# EAGLE design DAB+ FM Radio (EAGLE 9.0.0)
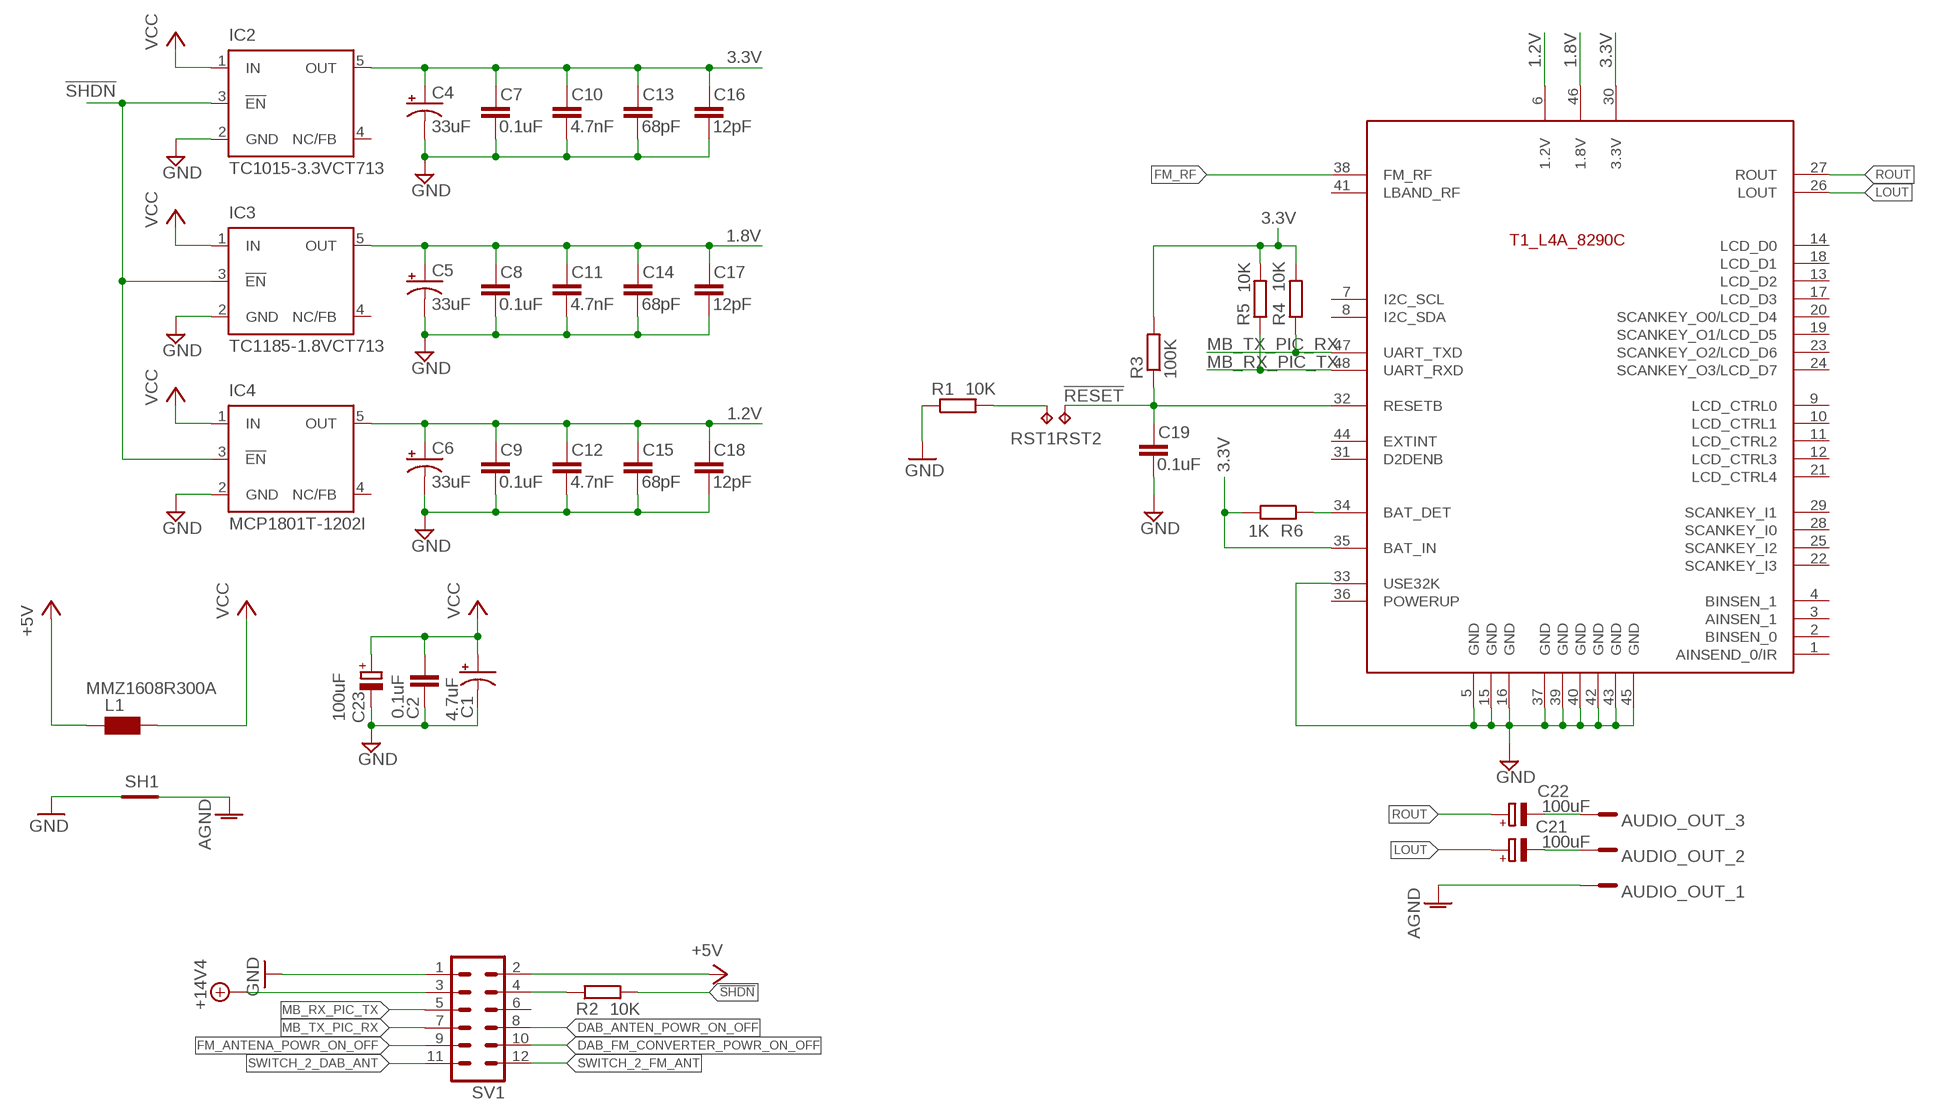
[diagram p0: schematic, sheet 1, part 1 of 2]
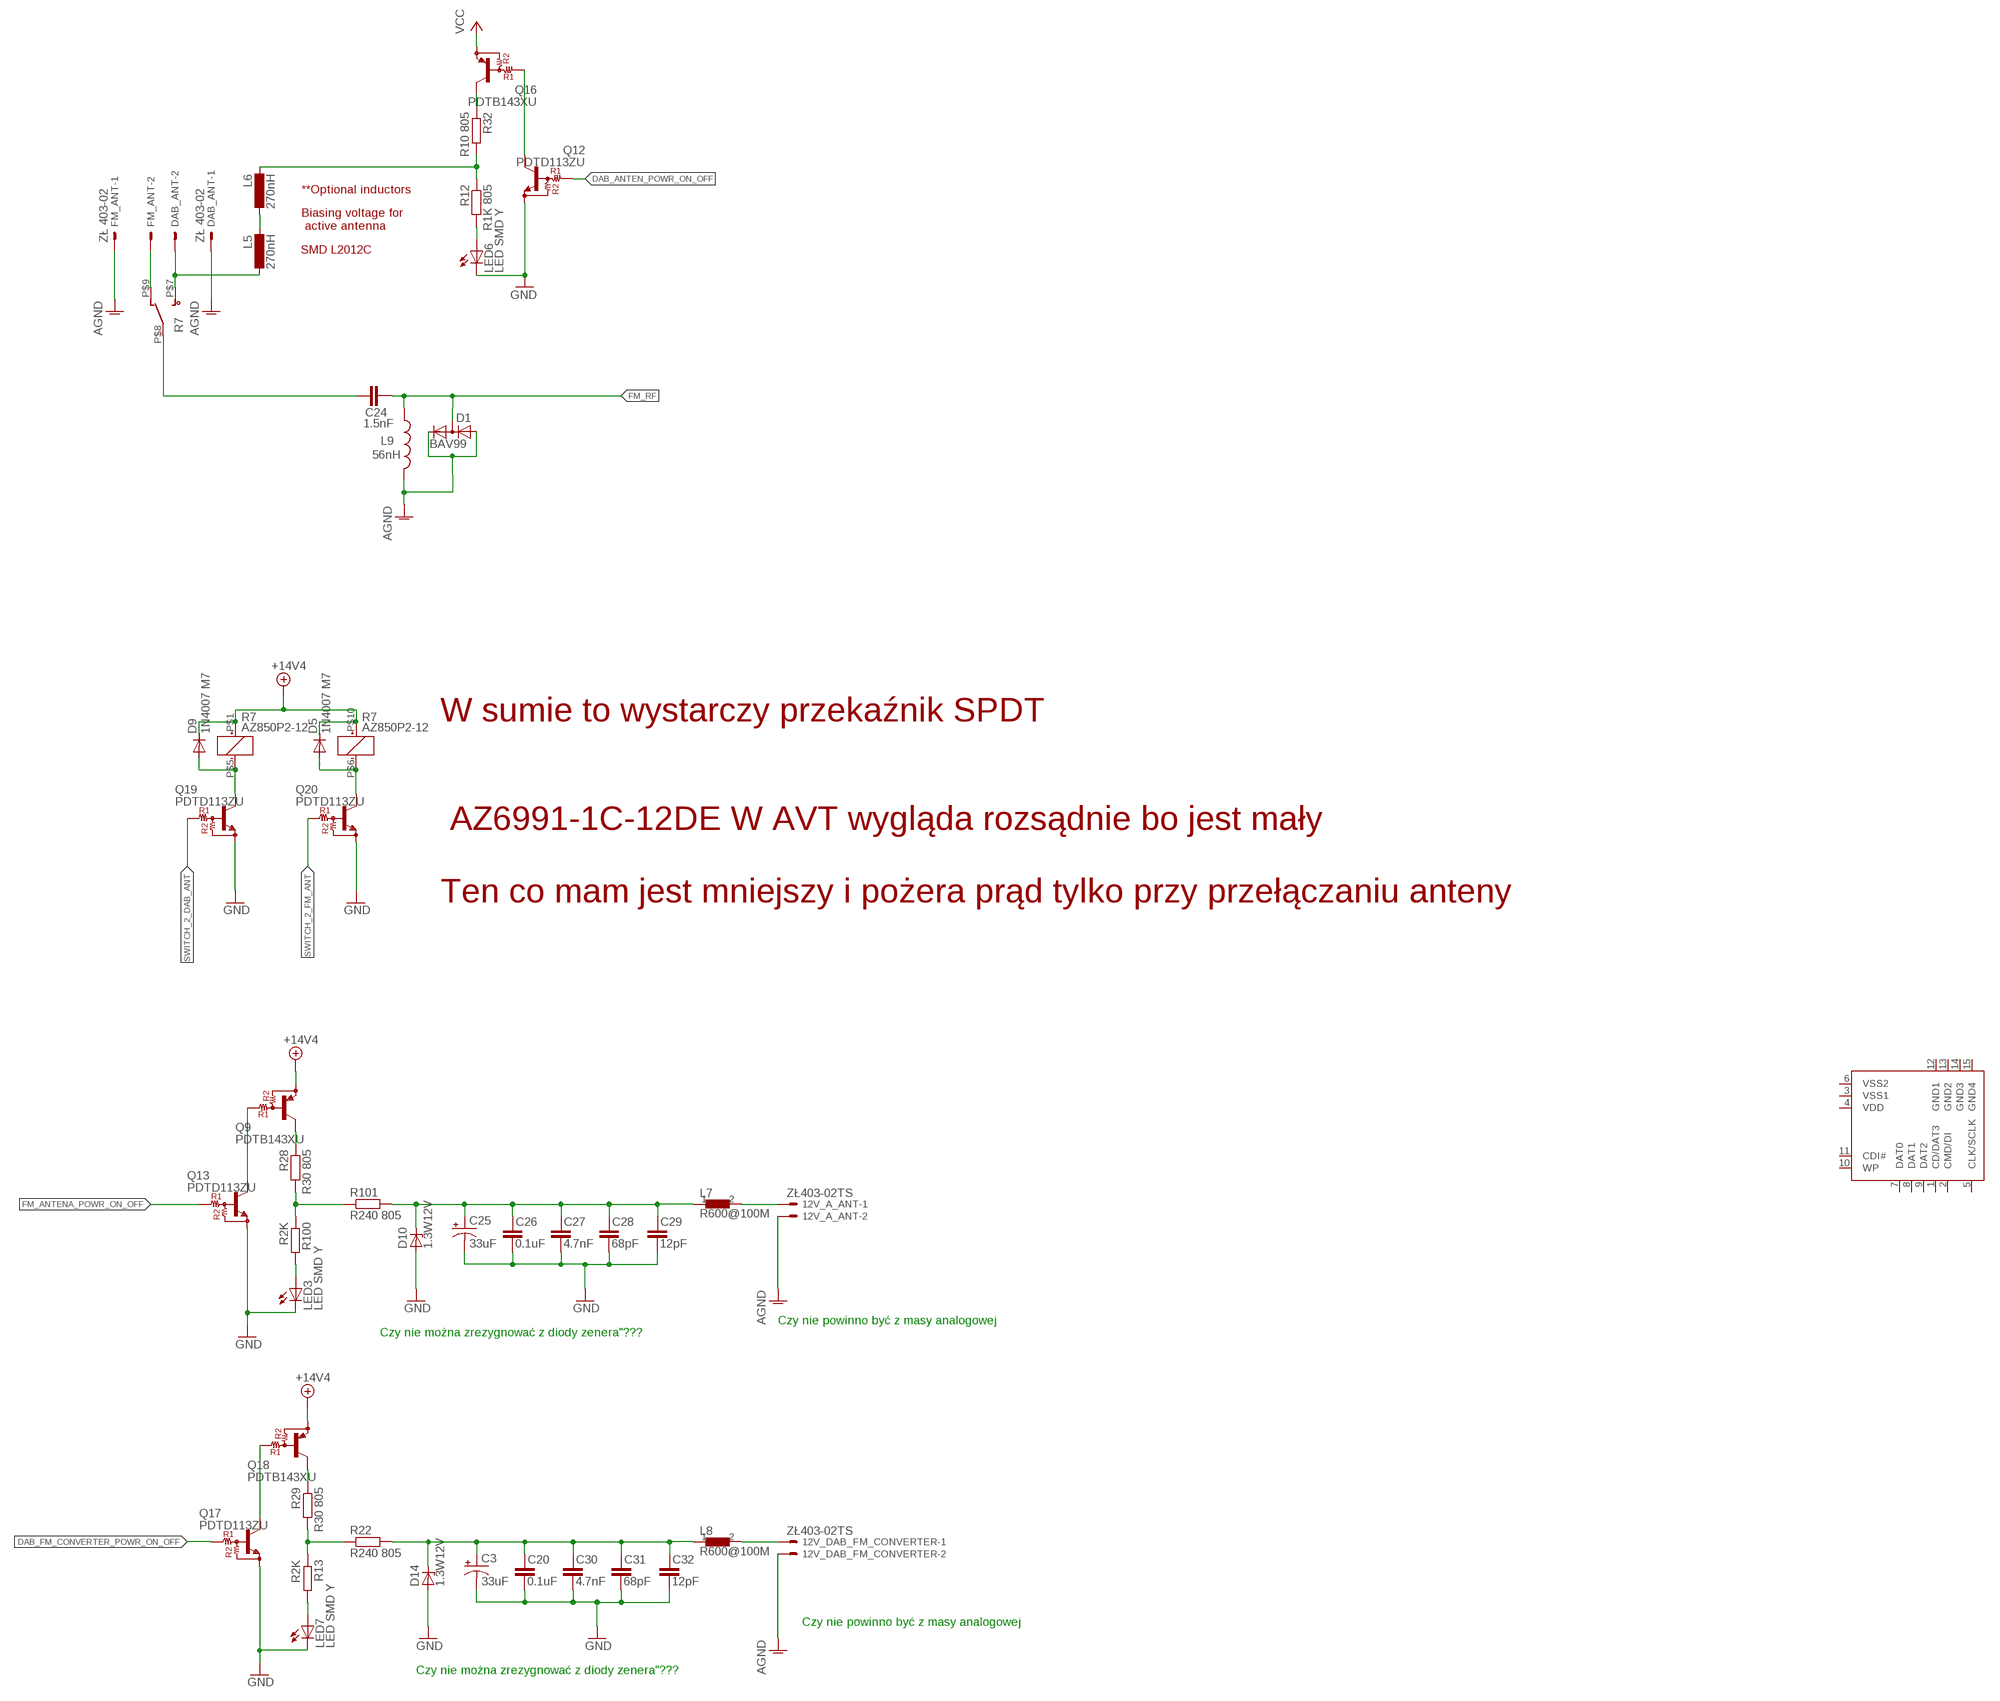
[diagram p1: schematic, sheet 1, part 2 of 2]

## Parts
12V_A_ANT  ZŁ403-02TS  22-23-2021  [22-23-2021]
12V_DAB_FM_CONVERTER  ZŁ403-02TS  22-23-2021  [22-23-2021]
AUDIO_OUT  JST_3_PIN_B3B-PH-KS  [B3B-PH-KS]
C1  4.7uF  CAP_POL1206  [EIA3216]
C2  0.1uF  C-EUC0603  [C0603]
C3  33uF  CAP_POL1206  [EIA3216]
C4  33uF  CAP_POL1206  [EIA3216]
C5  33uF  CAP_POL1206  [EIA3216]
C6  33uF  CAP_POL1206  [EIA3216]
C7  0.1uF  C-EUC0603  [C0603]
C8  0.1uF  C-EUC0603  [C0603]
C9  0.1uF  C-EUC0603  [C0603]
C10  4.7nF  C-EUC0603  [C0603]
C11  4.7nF  C-EUC0603  [C0603]
C12  4.7nF  C-EUC0603  [C0603]
C13  68pF  C-EUC0603  [C0603]
C14  68pF  C-EUC0603  [C0603]
C15  68pF  C-EUC0603  [C0603]
C16  12pF  C-EUC0603  [C0603]
C17  12pF  C-EUC0603  [C0603]
C18  12pF  C-EUC0603  [C0603]
C19  0.1uF  C-EUC0603  [C0603]
C20  0.1uF  C-EUC0603  [C0603]
C21  100uF  CPOL-EUD  [PANASONIC_D]
C22  100uF  CPOL-EUD  [PANASONIC_D]
C23  100uF  CPOL-EUD  [PANASONIC_D]
C24  1.5nF  C-EUC0603  [C0603]
C25  33uF  CAP_POL1206  [EIA3216]
C26  0.1uF  C-EUC0603  [C0603]
C27  4.7nF  C-EUC0603  [C0603]
C28  68pF  C-EUC0603  [C0603]
C29  12pF  C-EUC0603  [C0603]
C30  4.7nF  C-EUC0603  [C0603]
C31  68pF  C-EUC0603  [C0603]
C32  12pF  C-EUC0603  [C0603]
D1  BAV99  BAV199  [SOT23]
D5  1N4007 M7  CGRM4001-G  [SOD-123_MINI-SMA]
D9  1N4007 M7  CGRM4001-G  [SOD-123_MINI-SMA]
D10  1.3W12V  ZENER-DIODEZD-2.5  [ZDIO-2.5]
D14  1.3W12V  ZENER-DIODEZD-2.5  [ZDIO-2.5]
DAB_ANT  ZŁ 403-02  22-27-2021-02  [6410-02]
FM_ANT  ZŁ 403-02  22-27-2021-02  [6410-02]
IC2  TC1015-3.3VCT713  TPS77001  [SOT23-DBV]
IC3  TC1185-1.8VCT713  TPS77001  [SOT23-DBV]
IC4  MCP1801T-1202I  TPS77001  [SOT23-DBV]
L1  MMZ1608R300A  WE-CBF_0603  [0603]
L5  270nH  L-EUL2012C  [L2012C]
L6  270nH  L-EUL2012C  [L2012C]
L7  R600@100M  FERRITR0805  [R0805]
L8  R600@100M  FERRITR0805  [R0805]
L9  56nH  INDUCTOR0603  [0603]
LED3  LED SMD Y  LED  [SMARTLED-TTW]
LED6  LED SMD Y  LED  [SMARTLED-TTW]
LED7  LED SMD Y  LED  [SMARTLED-TTW]
Q9  PDTB143XU  [SOT-23]
Q12  PDTD113ZU  [SOT-23]
Q13  PDTD113ZU  [SOT-23]
Q16  PDTB143XU  [SOT-23]
Q17  PDTD113ZU  [SOT-23]
Q18  PDTB143XU  [SOT-23]
Q19  PDTD113ZU  [SOT-23]
Q20  PDTD113ZU  [SOT-23]
R1  10K  R-EU_R0603  [R0603]
R2  10K  R-EU_R0603  [R0603]
R3  100K  R-EU_R0603  [R0603]
R4  10K  R-EU_R0603  [R0603]
R5  10K  R-EU_R0603  [R0603]
R6  1K  R-EU_R0603  [R0603]
R7  AZ850P2-12  [AZ850-2C]
R12  R1K 805  R-EU_R0805  [R0805]
R13  R2K  R-EU_R0805  [R0805]
R22  R240 805  R-EU_M0805  [M0805]
R28  R30 805  R-EU_R0805  [R0805]
R29  R30 805  R-EU_R0805  [R0805]
R32  R10 805  R-EU_R0805  [R0805]
R100  R2K  R-EU_R0805  [R0805]
R101  R240 805  R-EU_M0805  [M0805]
RST1  TPB1,27  [B1,27]
RST2  TPB1,27  [B1,27]
SH1  SHORT-HT5  [SHORT_TOP-50]
SV1  MA06-2  [MA06-2]
U$1  T1_L4A_8290C/T2_L4A_8650C  T1_L4A_8290C  [T1_L4A]
U$6  ZŁ KART SD  SDCARDVAR2  [SDCMF-10915W010]

## Nets
1.2V: C6.A(+) C9.1 C12.1 C15.1 C18.1 IC4.5(OUT) U$1.6(1.2V)
1.8V: C5.A(+) C8.1 C11.1 C14.1 C17.1 IC3.5(OUT) U$1.46(1.8V)
3.3V: C4.A(+) C7.1 C10.1 C13.1 C16.1 IC2.5(OUT) R3.2 R4.2 R5.2 R6.2 U$1.30(3.3V) U$1.35(BAT_IN)
!RESET!: C19.1 R3.1 RST2.TP U$1.32(RESETB)
!SHDN!: IC2.3(!EN) IC3.3(!EN) IC4.3(!EN) R2.2
+5V: L1.1 SV1.2
+12V: D5.C D9.C Q9.2(E) Q18.2(E) R7.P$1(S$1:+) R7.P$10(R$2:+) SV1.3 ; supply symbol labelled +14V4
AGND: 12V_A_ANT.2 12V_DAB_FM_CONVERTER.2 AUDIO_OUT.P$1 D1.1(A) D1.2(C) DAB_ANT.1 FM_ANT.1 L9.2 SH1.2
DAB_ANTEN_POWR_ON_OFF: Q12.1(B) SV1.8
DAB_FM_CONVERTER_POWR_ON_OFF: Q17.1(B) SV1.10
FM_ANTENA_POWR_ON_OFF: Q13.1(B) SV1.9
FM_RF: C24.2 D1.3(AC) L9.1 U$1.38(FM_RF)
GND: C1.C(-) C2.2 C3.C(-) C4.C(-) C5.C(-) C6.C(-) C7.2 C8.2 C9.2 C10.2 C11.2 C12.2 C13.2 C14.2 C15.2 C16.2 C17.2 C18.2 C19.2 C20.2 C23.- C25.C(-) C26.2 C27.2 C28.2 C29.2 C30.2 C31.2 C32.2 D10.A D14.A IC2.2(GND) IC3.2(GND) IC4.2(GND) LED3.C@1(C) LED6.C@1(C) LED7.C@1(C) Q12.2(E) Q13.2(E) Q17.2(E) Q19.2(E) Q20.2(E) R1.1 SH1.1 SV1.1 U$1.5(GND) U$1.15(GND) U$1.16(GND) U$1.33(USE32K) U$1.37(GND) U$1.39(GND) U$1.40(GND) U$1.42(GND) U$1.43(GND) U$1.45(GND)
LOUT: C21.+ U$1.26(LOUT)
MB_RX_PIC_TX: R5.1 SV1.5 U$1.48(UART_RXD)
MB_TX_PIC_RX: R4.1 SV1.7 U$1.47(UART_TXD)
N$1: D5.A Q20.3(C) R7.P$6(R$2:-)
N$2: D9.A Q19.3(C) R7.P$5(S$1:-)
N$3: R6.1 U$1.34(BAT_DET)
N$4: C24.1 R7.P$8
N$5: DAB_ANT.2 L5.2 R7.P$7
N$6: AUDIO_OUT.P$3 C22.-
N$7: FM_ANT.2 R7.P$9
N$8: AUDIO_OUT.P$2 C21.-
N$9: L6.1 R12.1 R32.2
N$10: R2.1 SV1.4
N$12: L5.1 L6.2
N$13: R1.2 RST1.TP
N$20: Q12.3(C) Q16.1(B)
N$23: LED6.A@1(A) R12.2
N$25: Q17.3(C) Q18.1(B)
N$26: R13.1 R22.1 R29.2
N$27: LED7.A@1(A) R13.2
N$29: C3.A(+) C20.1 C30.1 C31.1 C32.1 D14.C L8.1 R22.2
N$30: 12V_DAB_FM_CONVERTER.1 L8.2
N$33: Q16.3(C) R32.1
N$34: Q9.3(C) R28.1
N$35: Q18.3(C) R29.1
N$85: Q9.1(B) Q13.3(C)
N$87: R28.2 R100.1 R101.1
N$88: LED3.A@1(A) R100.2
N$91: C25.A(+) C26.1 C27.1 C28.1 C29.1 D10.C L7.1 R101.2
N$92: 12V_A_ANT.1 L7.2
ROUT: C22.+ U$1.27(ROUT)
SWITCH_2_DAB_ANT: Q19.1(B) SV1.11
SWITCH_2_FM_ANT: Q20.1(B) SV1.12
VCC: C1.A(+) C2.1 C23.+ IC2.1(IN) IC3.1(IN) IC4.1(IN) L1.2 Q16.2(E)
Unconnected: IC2.4(NC/FB) IC3.4(NC/FB) IC4.4(NC/FB) R7.P$2 R7.P$3 R7.P$4 SV1.6 U$1.1(AINSEND_0/IR) U$1.2(BINSEN_0) U$1.3(AINSEN_1) U$1.4(BINSEN_1) U$1.7(I2C_SCL) U$1.8(I2C_SDA) U$1.9(LCD_CTRL0) U$1.10(LCD_CTRL1) U$1.11(LCD_CTRL2) U$1.12(LCD_CTRL3) U$1.13(LCD_D2) U$1.14(LCD_D0) U$1.17(LCD_D3) U$1.18(LCD_D1) U$1.19(SCANKEY_O1/LCD_D5) U$1.20(SCANKEY_O0/LCD_D4) U$1.21(LCD_CTRL4) U$1.22(SCANKEY_I3) U$1.23(SCANKEY_O2/LCD_D6) U$1.24(SCANKEY_O3/LCD_D7) U$1.25(SCANKEY_I2) U$1.28(SCANKEY_I0) U$1.29(SCANKEY_I1) U$1.31(D2DENB) U$1.36(POWERUP) U$1.41(LBAND_RF) U$1.44(EXTINT) U$6.1(CD/DAT3) U$6.2(CMD/DI) U$6.5(CLK/SCLK) U$6.7(DAT0) U$6.8(DAT1) U$6.9(DAT2) U$6.10(WP) U$6.11(CDI#)

## Notes on the sheet
- **Optional inductors
- Biasing voltage for
   active antenna
- SMD L2012C
- W sumie to wystarczy przekaźnik SPDT
  
  
   AZ6991-1C-12DE W AVT wygląda rozsądnie bo jest mały
  
  Ten co mam jest mniejszy i pożera prąd tylko przy przełączaniu anteny
- Czy nie powinno być z masy analogowej
- Czy nie można zrezygnować z diody zenera"???
- Czy nie powinno być z masy analogowej
- Czy nie można zrezygnować z diody zenera"???

## Power pins joined to a net without a drawn wire
GND1: U$6.12(GND1)
GND2: U$6.13(GND2)
GND3: U$6.14(GND3)
GND4: U$6.15(GND4)
VDD: U$6.4(VDD)
VSS1: U$6.3(VSS1)
VSS2: U$6.6(VSS2)

## Library data of the parts
12V_A_ANT 12V_DAB_FM_CONVERTER = con-molex:22-23-2021: .100" (2.54mm) Center Header - 2 Pin; MF: MOLEX; MPN: 22-23-2021; OC_FARNELL: 1462926; OC_NEWARK: 25C3832
AUDIO_OUT = conn-JST:JST_3_PIN_
C1 C3-C6 C25 = SparkFun:CAP_POL: Capacitor Polarized These are standard SMD and PTH capacitors. Normally 10uF, 47uF, and 100uF in electrolytic and tantalum varieties. Always verify the external diameter of the through hole cap, it varies with capacity, voltage, and manufacturer. The EIA devices should be standard.
C2 C7-C20 C24 C26-C32 = rcl:C-EU: CAPACITOR, European symbol
C21-C23 = rcl:CPOL-EU: POLARIZED CAPACITOR, European symbol
D1 = diode:BAV199: DIODE low-leakage double diode
D5 D9 = diode:CGRM400*-G: Molded plasitc,JEDEC SOD-123/Mini SMA Source: Comchip CGRM4001-G.pdf
D10 D14 = diode:ZENER-DIODE: Z-Diode
DAB_ANT FM_ANT = con-molex:22-?-02: CONNECTOR wire to board 2.54 mm (.1 inch) pitch header; OC_FARNELL: unknown; OC_NEWARK: unknown
IC2-IC4 = texas:TPS770*: ULTRALOW-POWER 50-mA LOW-DROPOUT LINEAR REGULATORS 50-mA Low-Dropout Regulator Source: http://focus.ti.com/lit/ds/symlink/tps77001.pdf; MF: TEXAS INSTRUMENTS; MPN: TPS77001DBVT; OC_FARNELL: 8461554; OC_NEWARK: 77C1171
L1 = wuerth-elektronik:WE-CBF: SMD EMI Suppression Ferrite Beads - excellent anti-EMI properties - low DCR - impedances till 3000 ohms - rated current up to 6 A
L5 L6 = resistor:L-EU: INDUCTOR, European symbol
L7 L8 = ferrit_bear:FERRIT
L9 = SparkFun:INDUCTOR: Inductors Basic Inductor/Choke - 0603 and 1206. Footprints are not proven and vary greatly between part numbers.
LED3 LED6 LED7 = adafruit:LED: LED OSRAM: - CHIPLED LG R971, LG N971, LY N971, LG Q971, LY Q971, LO R971, LY R971 LH N974, LH R974 LS Q976, LO Q976, LY Q976 LO Q996 - Hyper CHIPLED LW Q18S LB Q993, LB Q99A, LB R99A - SideLED LS A670, LO A670, LY A670, LG A670, LP A670 LB A673, LV A673, LT A673, LW A673 LH A674 LY A675 LS A676, LA A676, LO A676, LY A676, LW A676 LS A679, LY A679, LG A679 - Hyper Micro SIDELED® LS Y876, LA Y876, LO Y876, LY Y876 LT Y87S - SmartLED LW L88C, LW L88S LB L89C, LB L89S, LG L890 LS L89K, LO L89K, LY L89K LS L896, LA L896, LO L896, LY L896 - TOPLED LS T670, LO T670, LY T670, LG T670, LP T670 LSG T670, LSP T670, LSY T670, LOP T670, LYG T670 LG T671, LOG T671, LSG T671 LB T673, LV T673, LT T673, LW T673 LH T674 LS T676, LA T676, LO T676, LY T676, LB T676, LH T676, LSB T676, LW T676 LB T67C, LV T67C, LT T67C, LS T67K, LO T67K, LY T67K, LW E67C LS E67B, LA E67B, LO E67B, LY E67B, LB E67C, LV E67C, LT E67C LW T67C LS T679, LY T679, LG T679 LS T770, LO T770, LY T770, LG T770, LP T770 LB T773, LV T773, LT T773, LW T773 LH T774 LS E675, LA E675, LY E675, LS T675 LS T776, LA T776, LO T776, LY T776, LB T776 LHGB T686 LT T68C, LB T68C - Hyper Mini TOPLED® LB M676 - Mini TOPLED Santana® LG M470 LS M47K, LO M47K, LY M47K Source: http://www.osram.convergy.de/
Q9 Q16 Q18 = pre-bias-transistor:PDTB: PNP Resistor-Equipped Transistor (RET) family in a very small SOT323 (SC-70) Surface-Mounted Device (SMD) plastic package. VCC = -50 IC (max) = -500mA; R1: 4.7 kOhm; R2: 10 kOhm
Q12 Q13 Q17 Q19 Q20 = pre-bias-transistor:PDTD: Pre biase NPN transistor NPN Resistor-Equipped Transistor (RET) family in a very small SOT323 (SC-70) Surface-Mounted Device (SMD) plastic package. VCC = 50V Ic (max) = 500 mA; R1: 1 kOhm; R2: 10 kOhm
R1-R6 R12 R13 R22 R28 R29 R32 R100 R101 = rcl:R-EU_: RESISTOR, European symbol
R7 = relay_silelis:AZ850P2-12
RST1 RST2 = testpad:TP: Test pad
SH1 = shorts-old:SHORT-H: Short between two nets; BOM: no
SV1 = con-lstb:MA06-2: PIN HEADER; OC_FARNELL: unknown; OC_NEWARK: unknown
U$1 = Monkey:T1_L4A_8290C
U$6 = kingfont_sdcmf10915w010_covek:SDCARD: SD card connector KINGFONT SDCMF-10915W010

## Net classes
0 default: clearance 0.203 mm

## Board
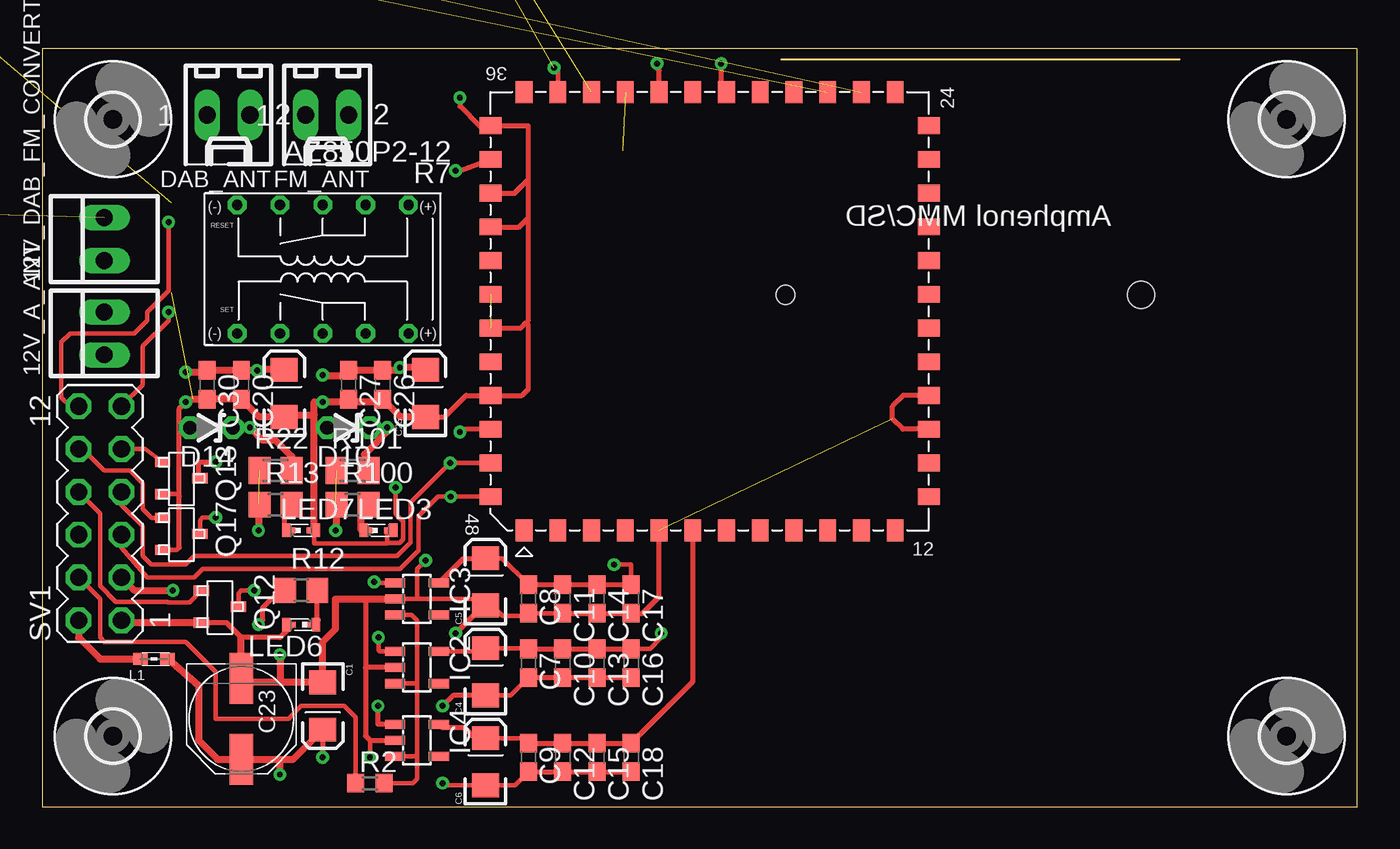
[diagram p2: board, top side]
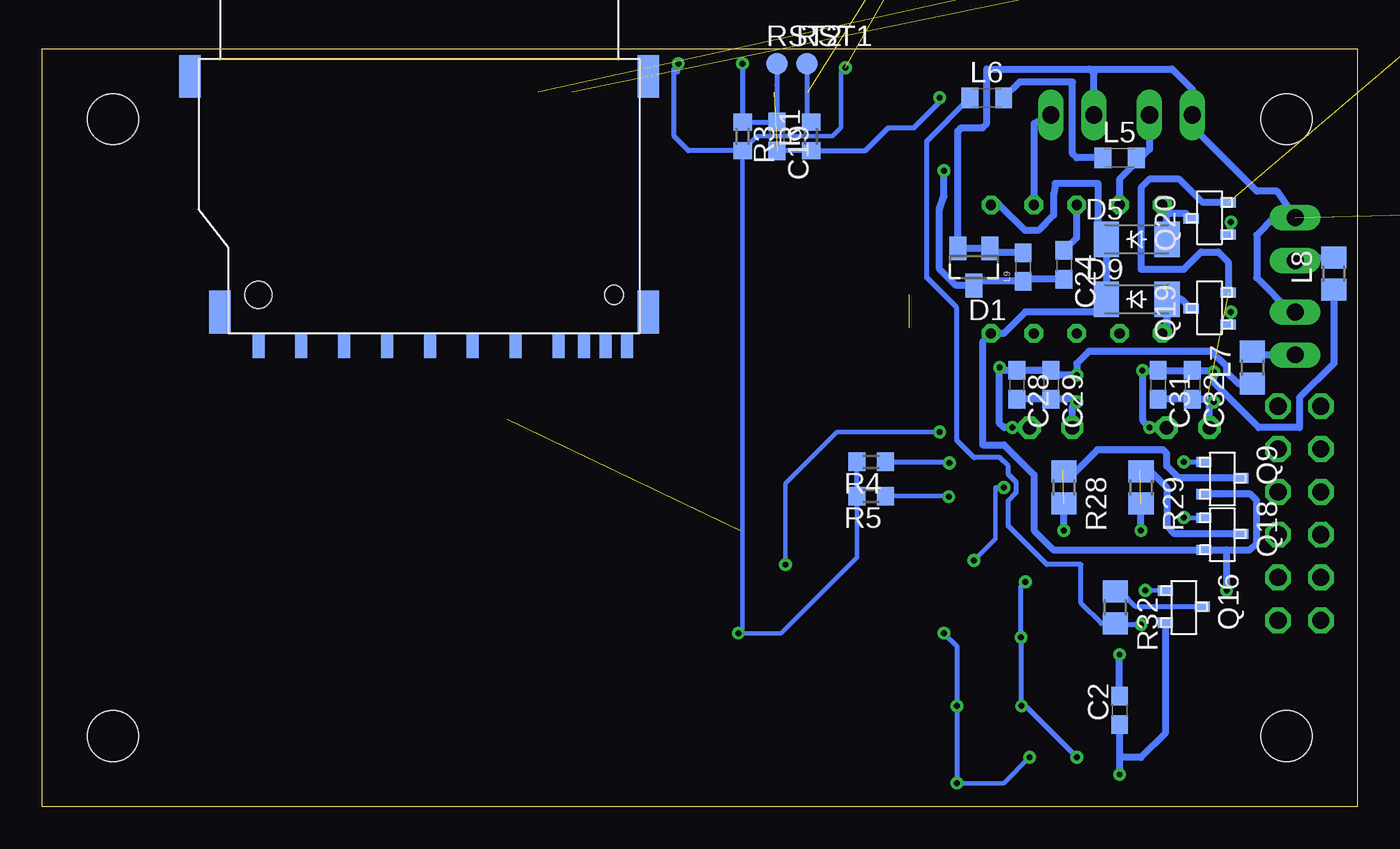
[diagram p3: board, bottom side, seen from below]

Size 77.98 x 44.96 mm. Coordinates in mm from the lower left corner, seen from the top.
Outline: 0,0 77.98,0 77.98,44.96 0,44.96 0,0
Copper layers (1*16): Top 0.035mm / dielectric 1.5mm / Bottom 0.035mm
Design rules "default": minimum track width 6mil, minimum drill 0.35mm, track to track 6mil, track to pad 6mil, pad to pad 6mil, via to via 6mil, smd to smd 6mil, copper to edge 40mil, drill to drill 6mil, minimum pad ring 10mil, minimum via ring 8mil, stop-mask expansion 4mil, vias tented up to drill 0mil, thermal gap 10mil

### Footprints (pad centres in the part's own frame; a part is rotated, then mirrored left to right if it is on the bottom)
22-23-2021 = drill 1 long: 1 -1.27,0; 2 1.27,0
B3B-PH-KS = drill 0.75 pad 1.2 square: P$1 -2,1.7; P$2 -4,1.7; P$3 -6,1.7
EIA3216 = smd 1.4 x 1.6: A 1.4,0; C -1.4,0
C0603 = smd 1.1 x 1: 1 -0.85,0; 2 0.85,0
PANASONIC_D = smd 3 x 1.4: + 2.4,0; - -2.4,0
SOT23 = smd 1 x 1.4: 1 -0.95,-1.1; 2 0.95,-1.1; 3 0,1.1
SOD-123_MINI-SMA = smd 1.5 x 2.1: A 1.8,0; C -1.8,0
ZDIO-2.5 = drill 0.813 octagon: A 1.27,0; C -1.27,0
6410-02 = drill 1.016 long: 1 1.27,0; 2 -1.27,0
SOT23-DBV = smd 0.55 x 1.2: 1 -0.95,-1.3; 2 0,-1.3; 3 0.95,-1.3; 4 0.95,1.3; 5 -0.95,1.3
0603 = smd 0.85 x 0.7: 1 -0.9,0; 2 0.7,0
L2012C = smd 1 x 1.2: 1 -1,0; 2 1,0
R0805 = smd 1.3 x 1.5: 1 -0.95,0; 2 0.95,0
0603' = smd 1.1 x 1: 1 -0.85,0; 2 0.85,0
SMARTLED-TTW = smd 0.8 x 0.5: A 0,-0.875; C 0,0.875 | smd 0.35 x 0.35: A@1 0,-0.5; C@1 0,0.5
SOT-23 = smd 0.6 x 0.9: 1 -1,-1.1; 2 0.9,-1.1; 3 -0.05,1.1
R0603 = smd 1 x 1.1: 1 -0.85,0; 2 0.85,0
AZ850-2C = drill 0.6 octagon: P$1 -5.08,3.81; P$2 -2.54,3.81; P$3 0,3.81; P$4 2.54,3.81; P$5 5.08,3.81; P$6 5.08,-3.81; P$7 2.54,-3.81; P$8 0,-3.81; P$9 -2.54,-3.81; P$10 -5.08,-3.81
M0805 = smd 1.3 x 1.6: 1 -0.95,0; 2 0.95,0
B1,27 = smd 1.27 x 1.27: TP 0,0
SHORT_TOP-50 = smd 1.27 x 1.27: 1 0.635,0; 2 -0.635,0
MA06-2 = drill 1.016 octagon: 1 -6.35,-1.27; 2 -6.35,1.27; 3 -3.81,-1.27; 4 -3.81,1.27; 5 -1.27,-1.27; 6 -1.27,1.27; 7 1.27,-1.27; 8 1.27,1.27; 9 3.81,-1.27; 10 3.81,1.27; 11 6.35,-1.27; 12 6.35,1.27
T1_L4A = smd 1.3 x 1: 1 0,0; 2 0,-2; 3 0,-4; 4 0,-6; 5 0,-8; 6 0,-10; 7 0,-12; 8 0,-14; 9 0,-16; 10 0,-18; 11 0,-20; 12 0,-22; 25 26,-22; 26 26,-20; 27 26,-18; 28 26,-16; 29 26,-14; 30 26,-12; 31 26,-10; 32 26,-8; 33 26,-6; 34 26,-4; 35 26,-2; 36 26,0 | smd 1 x 1.3: 13 2,-24; 14 4,-24; 15 6,-24; 16 8,-24; 17 10,-24; 18 12,-24; 19 14,-24; 20 16,-24; 21 18,-24; 22 20,-24; 23 22,-24; 24 24,-24; 37 24,2; 38 22,2; 39 20,2; 40 18,2; 41 16,2; 42 14,2; 43 12,2; 44 10,2; 45 8,2; 46 6,2; 47 4,2; 48 2,2
3,0 = hole 3: 0,0
SDCMF-10915W010 = smd 0.711 x 1.422: 1 7.366,13.462; 2 4.826,13.462; 3 2.286,13.462; 4 -0.254,13.462; 5 -2.794,13.462; 6 -5.334,13.462; 7 -7.874,13.462; 8 -9.398,13.462; 9 9.906,13.462; 10 -11.938,13.462; 11 -10.668,13.462 | smd 1.27 x 2.54: 12 12.192,11.43; 13 13.97,-2.54; 14 -13.208,-2.54; 15 -13.208,11.43 | hole 1.6: 9.906,10.414 | hole 1.1: -11.176,10.414

### Placement (x,y rotation side)
12V_A_ANT  3.68,28.07 90 top
12V_DAB_FM_CONVERTER  3.68,33.66 90 top
AUDIO_OUT  -68.96,35.18 0 top  (outside the outline)
C1  16.64,5.97 270 top
C2  14.1,5.71 90 bottom
C3  14.35,24.51 90 top
C4  26.29,8 90 top
C5  26.29,13.34 90 top
C6  26.29,2.67 90 top
C7  28.83,8.51 270 top
C8  28.83,12.32 270 top
C9  28.83,2.92 270 top
C10  30.86,8.51 270 top
C11  30.86,12.32 270 top
C12  30.86,2.92 270 top
C13  32.89,8.51 270 top
C14  32.89,12.32 270 top
C15  32.89,2.92 270 top
C16  34.92,8.51 270 top
C17  34.92,12.32 270 top
C18  34.92,2.92 270 top
C19  34.42,39.75 270 bottom
C20  11.81,25.02 270 top
C21  -53.72,64.39 0 top  (outside the outline)
C22  -62.61,64.39 0 top  (outside the outline)
C23  11.81,5.21 270 top
C24  17.4,32.13 270 bottom
C25  22.73,24.51 90 top
C26  20.19,25.02 270 top
C27  18.16,25.02 270 top
C28  20.19,25.02 270 bottom
C29  18.16,25.02 270 bottom
C30  9.78,25.02 270 top
C31  11.81,25.02 270 bottom
C32  9.78,25.02 270 bottom
D1  22.73,32 180 bottom
D5  13.08,33.66 0 bottom
D9  13.08,30.1 0 bottom
D10  18.16,22.48 180 top
D14  10.03,22.48 180 top
DAB_ANT  11.05,41.02 180 top
FM_ANT  16.89,41.02 180 top
IC2  22.22,8.25 270 top
IC3  22.22,12.32 270 top
IC4  22.22,3.94 270 top
L1  6.73,8.76 0 top
L5  14.1,38.48 0 bottom
L6  21.97,42.04 0 bottom
L7  6.22,26.04 90 bottom
L8  1.4,31.62 90 bottom
L9  56nH  [0603']  19.81,32 90 bottom
LED3  19.94,16.38 270 top
LED6  15.37,10.79 90 top
LED7  15.37,16.38 270 top
Q9  8,19.43 270 bottom
Q12  10.54,11.81 270 top
Q13  8.25,19.43 270 top
Q16  10.29,11.81 270 bottom
Q17  8.25,16.13 270 top
Q18  8,16.13 270 bottom
Q19  8.76,29.59 90 bottom
Q20  8.76,34.92 90 bottom
R1  32.38,39.75 90 bottom
R2  19.43,1.4 0 top
R3  36.45,39.75 270 bottom
R4  28.83,20.45 180 bottom
R5  28.83,18.41 180 bottom
R6  -1.65,98.68 0 top  (outside the outline)
R7  16.64,31.88 180 top
R12  15.37,12.83 0 top
R13  13.84,17.91 0 top
R22  13.84,19.94 0 top
R28  17.4,18.92 270 bottom
R29  12.83,18.92 270 bottom
R32  14.35,11.81 270 bottom
R100  18.41,17.91 0 top
R101  18.41,19.94 0 top
RST1  32.64,44.07 0 bottom
RST2  34.42,44.07 0 bottom
SH1  -63.88,96.14 0 top  (outside the outline)
SV1  3.43,17.4 90 top
U$1  28.57,16.38 90 top
U$2  [3,0]  4.19,40.77 0 top
U$3  [3,0]  4.19,4.19 0 top
U$4  [3,0]  73.79,40.77 0 top
U$5  [3,0]  73.79,4.19 0 top
U$6  55.24,40.77 180 bottom

### Tracks (layer width: path | path; a pad name or v marks a point on that pad's centre or on a via)
1.2V
  Top 0.254: C6.A 28.53,4.07 C9.1
  Top 0.305: IC4.5 23.71,4.7 25.02,4.7 25.65,4.07 C6.A 26.58,3.77 | C9.1 C12.1 C15.1 C18.1 38.57,7.42 U$1.6
1.8V  (via drill 0.35)
  Top 0.254: C5.A 27.26,14.73 C8.1 | C17.1 34.92,14.35 v33.91,14.35 | v24.77,22.22 24.92,22.38 U$1.46
  Top 0.305: 26.16,14.61 C5.A | C5.A 26.41,14.73 | C8.1 C11.1 C14.1 C17.1 | IC3.5 24.99,14.73 C5.A
  Bottom 0.254: v33.91,14.35 33.91,19.18 30.86,22.22 v24.77,22.22
3.3V  (via drill 0.35)  (1 unrouted)
  Top 0.254: IC2.5 26.09,9.21 C4.A 28.79,9.4 | U$1.35 30.57,43.59 v30.35,43.81 v30.35,43.82 | C16.1 36.03,9.36 36.7,10.03 v36.7,10.29
  Top 0.305: 28.79,9.4 C7.1 C10.1 C13.1 C16.1 | v40.26,44.07 40.26,42.7 U$1.30
  Bottom 0.254: v30.35,43.82 30.61,43.56 30.61,40.26 31.11,39.75 35.6,39.75 R3.2 36.45,10.54 v36.7,10.29 34.16,10.29 29.68,14.77 R5.2
  Bottom 0.305: R5.2 R4.2 | R3.2 39.66,38.9 40.51,39.75 40.51,43.79 40.29,43.56 v40.26,44.07
!RESET!  (via drill 0.35)
  Top 0.305: U$1.32 36.57,43.66 36.45,43.79 v36.45,44.07
  Bottom 0.305: v36.45,44.07 R3.1 C19.1 34.42,42.8 RST2.TP
!SHDN!
  Top 0.254: R2.2 21.97,1.4 22.22,1.65 22.22,3.17 | 22.22,3.17 22.22,7.24 | 22.22,7.24 22.22,11.05 21.9,11.37 IC3.3 | IC2.3 22.16,7.3 22.22,7.24 | IC4.3 22.16,2.99 22.22,3.17
+5V
  Top 0.406: SV1.2 2.16,10.03 3.43,8.76 L1.1
+12V  (via drill 0.35)
  Top 0.406: SV1.3 5.46,12.83 v7.75,12.83
  Bottom 0.406: D5.C D9.C 15.62,29.36 15.62,29.34 19.68,29.34 20.95,28.07 R7.P$1 22.22,27.56 22.22,21.46 20.95,21.46 19.18,19.68 19.18,16.38 18.02,15.23 Q18.2 7.75,15.23 | D5.C 14.88,34.44 | R7.P$10 21.21,35.69 19.68,34.16 18.92,34.16 18.01,35.08 18.01,36.34 18,36.36 17.91,36.96 15.37,36.96 15.37,34.67 14.88,34.19 D5.C | 7.75,15.23 6.36,15.23 5.97,15.62 5.97,18.16 6.34,18.53 Q9.2 | v7.75,12.83 7.75,15.23
AGND  (2 unrouted)
  Bottom 0.406: L9.2 21.53,32.85 D1.1 D1.2 | 23.75,33.1 D1.2 | 12V_A_ANT.2 3.94,29.34 5.97,31.37 5.97,33.91 4.95,34.92 12V_DAB_FM_CONVERTER.2 4.75,36.5 5.96,36.5 9.78,40.32 DAB_ANT.1 9.78,42.55 10.97,43.74 15.88,43.74 | 15.88,43.74 21.97,43.74 21.97,40.51 22.22,40.26 23.49,40.26 23.68,40.07 D1.2 | FM_ANT.1 15.62,43.48 15.88,43.74
DAB_ANTEN_POWR_ON_OFF
  Top 0.254: SV1.8 3.43,17.4 3.43,13.08 4.37,12.14 7.43,12.14 7.45,12.12 8.75,12.12 Q12.1
DAB_FM_CONVERTER_POWR_ON_OFF
  Top 0.254: SV1.10 2.41,21.21 3.68,19.94 5.21,19.94 5.97,19.18 5.97,17.65 6.49,17.13 Q17.1
FM_ANTENA_POWR_ON_OFF
  Top 0.254: SV1.9 6.12,21.21 Q13.1
FM_RF  (via drill 0.35)
  Top 0.305: U$1.38 24.61,37.62 v24.51,37.72
  Bottom 0.406: C24.2 19.68,31.28 L9.1 22.48,31.15 D1.3 23.79,30.9 24.77,31.88 24.77,35.43 24.51,36.2 v24.51,37.72
GND  (via drill 0.35)  (5 unrouted)
  Top 0.254: LED7.C@1 16.13,16.13 16.13,15.62 20.44,15.62 | LED3.C@1 20.44,15.62 | 20.44,15.62 20.45,15.62 20.48,15.65 21.2,15.65 21.39,15.85 21.39,16.92 20.95,17.36 v20.95,18.92 | Q13.2 8.01,18.53 8.13,18.41 | Q17.2 7.99,15.23 8.13,15.37 | v22.73,14.61 22.22,14.1 22.22,12.32 IC3.2 25.9,12.32 C5.C | 26.67,11.93 27.3,11.3 28.66,11.3 C8.2 C11.2 | C4.C 27.77,6.6 C7.2 | C9.2 28.02,1.27 C6.C 23.88,1.27 v23.75,1.4 v23.75,1.39 | v19.43,2.92 19.43,3.94
  Top 0.305: Q17.2 7.1,15.23 | 7.38,18.53 Q13.2 | 8.13,15.37 8.13,18.41 8.13,23.62 v8.51,24 | LED6.C@1 14.11,10.03 11.81,10.03 10.93,10.91 Q12.2 | 20.7,12.32 IC3.2 | 19.18,12.32 19.18,8.25 | 19.18,8.25 19.18,4.19 19.43,3.94 IC4.2 | IC2.2 19.18,8.25 | C9.2 C12.2 C15.2 C18.2 | C7.2 C10.2 C13.2 C16.2 | 26.67,11.93 C5.C 26.16,11.93 v24.51,10.29 | C11.2 C14.2 C17.2 35.6,11.47 36.57,12.45 U$1.5 | U$1.16 51.05,24.38 50.42,23.75 50.42,22.99 51.02,22.38 U$1.15 | U$1.39 28,36.38 28.83,37.21 | 28.83,37.21 28.83,40.38 U$1.37 25.91,40.38 24.77,41.53 v24.77,42.04 | U$1.40 28.29,34.38 28.83,34.92 | 28.83,34.92 28.83,37.21 | U$1.43 28.38,28.38 28.7,28.7 | 28.83,34.92 28.83,28.83 28.7,28.7 | 28.7,28.7 28.83,28.57 28.83,24.77 28.45,24.38 U$1.45 25.14,24.38 23.87,23.11 C25.C | C4.C 24.38,6.6 v23.75,5.97
  Top 0.406: C27.2 arc-90 18,24 | 18,24 v16.64,24 16.13,24 16.13,23.24 | 18,24 20.03,24 arc90 C28.2 21.25,23.11 C25.C | C3.C 12.87,23.11 C31.2 C30.2 8.93,24.17 v8.51,24 | C3.C 14.73,23.49 | 16.13,16.13 16.13,23.24 | C3.C 14.48,23.24 16.13,23.24 | Q12.2 4.84,10.91 SV1.1 | 11.81,10.03 C23.- 12.05,7.37 14.1,7.37 | 14.1,7.37 C1.C 16.64,9.78 17.4,10.54 17.4,12.32 19.18,12.32 20.7,12.32 | v14.1,9.02 14.1,7.37
  Bottom 0.254: v22.73,14.61 21.46,15.88 21.46,18.92 v20.95,18.92 | v23.75,1.39 20.96,1.39 v19.43,2.92
  Bottom 0.305: C19.2 R1.1 29.17,38.9 27.81,40.26 26.29,40.26 24.77,41.78 v24.77,42.04 | v23.75,1.39 v23.75,5.97 23.75,9.52 v24.51,10.29
  Bottom 0.406: Q20.2 9.16,35.82 10.54,37.21 12.32,37.21 12.83,36.7 12.83,31.88 10.29,31.88 9.27,32.89 8.25,32.89 7.66,32.3 Q19.2 | C28.2 C27.2 16.8,24.17 arc90 v16.64,24 16.89,23.75 D10.A | 9.69,24.26 C30.2 | C30.2 C31.2 | C30.2 8.93,24.17 v8.51,24 8.76,23.75 D14.A | C2.2 v14.1,9.02
LOUT  (1 unrouted)
MB_RX_PIC_TX  (via drill 0.35)
  Top 0.254: U$1.48 v24.22,18.38 23.46,18.38 22.31,17.23 22.31,15.2 21.21,14.1 9.52,14.1 9.02,13.59 6.22,13.59 4.7,15.37 SV1.5
  Bottom 0.254: R5.1 24.26,18.41 v24.22,18.38
MB_TX_PIC_RX  (via drill 0.35)
  Top 0.254: U$1.47 v24.19,20.38 21.85,18.04 21.85,15.66 21.05,14.86 9.02,14.86 8.51,14.35 6.48,14.35 5.97,14.86 5.97,16.64 4.7,17.91 SV1.7
  Bottom 0.305: v24.19,20.38 24.26,20.45 R4.1
N$1
  Bottom 0.406: D5.A 11.28,35.18 | 11.28,35.18 11.28,35.41 R7.P$6 | Q20.3 10.17,35.18 11.28,35.18
N$2
  Bottom 0.406: R7.P$5 11.28,28.34 D9.A 10.42,30.1 Q19.3
N$3  (1 unrouted)
N$4
  Bottom 0.406: C24.1 16.64,33.74 R7.P$8
N$5
  Bottom 0.406: R7.P$7 14.1,37.21 13.1,38.21 L5.2 12.83,38.48 12.32,38.99 DAB_ANT.2
N$6  (1 unrouted)
N$7
  Bottom 0.406: FM_ANT.2 19.18,40.51 R7.P$9
N$8  (1 unrouted)
N$9  (via drill 0.35)
  Top 0.305: v12.83,10.79 13.08,11.05 13.08,11.81 14.1,12.83 R12.1
  Bottom 0.305: v12.83,10.79 14.29,10.79 R32.2 15.18,10.86 16.38,12.07 16.38,14.35 18.41,14.35 20.7,16.64 20.7,18.14 20.22,18.62 20.22,19.23 20.7,19.71 20.7,20.19 21.21,20.7 22.73,20.7 23.75,21.72 23.75,29.59 25.53,31.37 25.53,39.48 L6.1
N$10
  Top 0.254: SV1.4 3.43,12.32 3.43,10.03 3.68,9.78 8.51,9.78 10.29,8 10.29,5.21 14.61,5.21 15.37,5.97 17.91,5.97 18.58,5.29 R2.1
N$12
  Bottom 0.406: L5.1 16.64,38.48 16.89,38.73 16.89,42.98 20.03,42.98 L6.2
N$13
  Bottom 0.305: RST1.TP 32.64,40.85 R1.2
N$20  (via drill 0.35)
  Top 0.254: Q12.3 11.64,12.66 11.81,12.83 v12.57,12.83
  Bottom 0.254: v12.57,12.83 12.56,12.81 Q16.1
N$23
  Top 0.305: LED6.A@1 16.13,10.79 16.38,11.05 16.32,11.11 R12.2
N$25  (via drill 0.35)
  Top 0.254: Q17.3 9.36,16.98 9.52,17.14 v10.29,17.14
  Bottom 0.254: Q18.1 10.27,17.13 v10.29,17.14
  Bottom 0.305: 9.12,17.14 Q18.1
N$26  (via drill 0.35)  (1 unrouted)
  Top 0.406: R13.1 12.83,17.84 v12.83,16.38
  Bottom 0.406: v12.83,16.38 R29.2
N$27
  Top 0.305: R13.2 arc90 14.35,17.46 14.35,16.38 LED7.A@1
N$29  (via drill 0.35)
  Top 0.406: v8.51,25.78 9.69,25.78 C32.1 C31.1 11.85,25.91 11.89,25.87 v12.74,25.87 12.78,25.91 C3.A | R22.2 14.79,20.77 13.84,21.72 13.08,21.72 v12.32,22.48
  Bottom 0.406: 1.22,30.49 L8.1 1.4,26.29 3.43,24.26 3.43,22.48 5.85,22.48 8.51,25.14 v8.51,25.78 8.6,25.87 C32.1 C31.1 v12.74,25.87 12.72,25.85 12.72,22.88 v12.32,22.48 D14.C
N$30
  Bottom 0.406: 12V_DAB_FM_CONVERTER.1 3.5,32.57 L8.2
N$33
  Bottom 0.305: Q16.3 13.13,11.86 14.03,12.76 R32.1
N$34
  Bottom 0.406: Q9.3 10.59,19.48 11.3,20.19 11.3,20.95 11.51,21.16 15.42,21.16 16.7,19.87 R28.1
N$35
  Bottom 0.406: Q18.3 10.84,16.18 11.3,16.64 11.3,18.92 12.25,19.87 R29.1 12.51,19.87
N$85  (via drill 0.35)
  Top 0.305: Q13.3 9.27,19.56 9.27,20.45 v10.29,20.45
  Bottom 0.305: v10.29,20.45 9.12,20.45 Q9.1
N$87  (via drill 0.35)  (1 unrouted)
  Top 0.406: R100.1 17.46,17.59 v17.4,16.38
  Bottom 0.406: v17.4,16.38 R28.2
N$88
  Top 0.406: R100.2 18.92,17.91 18.92,16.38 LED3.A@1
N$91  (via drill 0.35)
  Top 0.406: v16.64,25.59 16.64,25.53 17.82,25.53 arc90 C29.1 C28.1 21.04,25.87 v21.21,26.04 22.61,26.04 C25.A arc-90 22.69,25.87 | R101.2 19.11,20.89 20.7,22.48 v20.45,22.48
  Bottom 0.406: L7.1 7.05,25.08 7.72,25.76 7.72,26.11 8.67,27 15.93,27 16.64,26.29 v16.64,25.59 17.89,25.59 C29.1 C28.1 21.04,25.87 v21.21,26.04 21.21,22.73 20.95,22.48 v20.45,22.48 D10.C
N$92
  Bottom 0.406: 12V_A_ANT.1 6.04,26.8 L7.2
ROUT  (1 unrouted)
SWITCH_2_DAB_ANT  (via drill 0.35)
  Top 0.254: SV1.11 5.97,25.02 5.97,27.3 7.49,28.83 v7.49,29.34
  Bottom 0.254: v7.49,29.34 7.49,28.76 Q19.1
SWITCH_2_FM_ANT  (via drill 0.35)
  Top 0.254: v7.49,34.67 7.49,30.61 6.22,29.34 6.22,28.83 5.46,28.07 1.65,28.07 1.14,27.56 1.14,24.26 1.65,23.75 SV1.12
  Bottom 0.406: Q20.1 7.49,34.09 v7.49,34.67
VCC  (via drill 0.35)
  Top 0.254: IC3.1 19.75,13.27 v19.68,13.34 | IC2.1 20,9.21 19.94,9.27 v19.94,10.03
  Top 0.305: C1.A v16.64,2.92 | IC4.1 19.91,4.89 v19.91,5.97
  Top 0.406: L1.2 9.27,7.18 9.27,3.94 10.4,2.81 C23.+ 14.1,2.81 | 14.1,2.81 14.88,2.81 C1.A | v14.1,1.9 14.1,2.81
  Bottom 0.305: v19.68,13.34 19.94,13.08 v19.94,10.03 19.91,10 v19.91,5.97 19.68,5.97 v16.64,2.92
  Bottom 0.406: C2.1 14.1,2.92 | 14.1,2.92 v14.1,1.9 | Q16.2 11.39,4.36 12.83,2.92 14.1,2.92